# EAGLE design stamp-fixed-mk-4.1 (EAGLE 6.5.0)
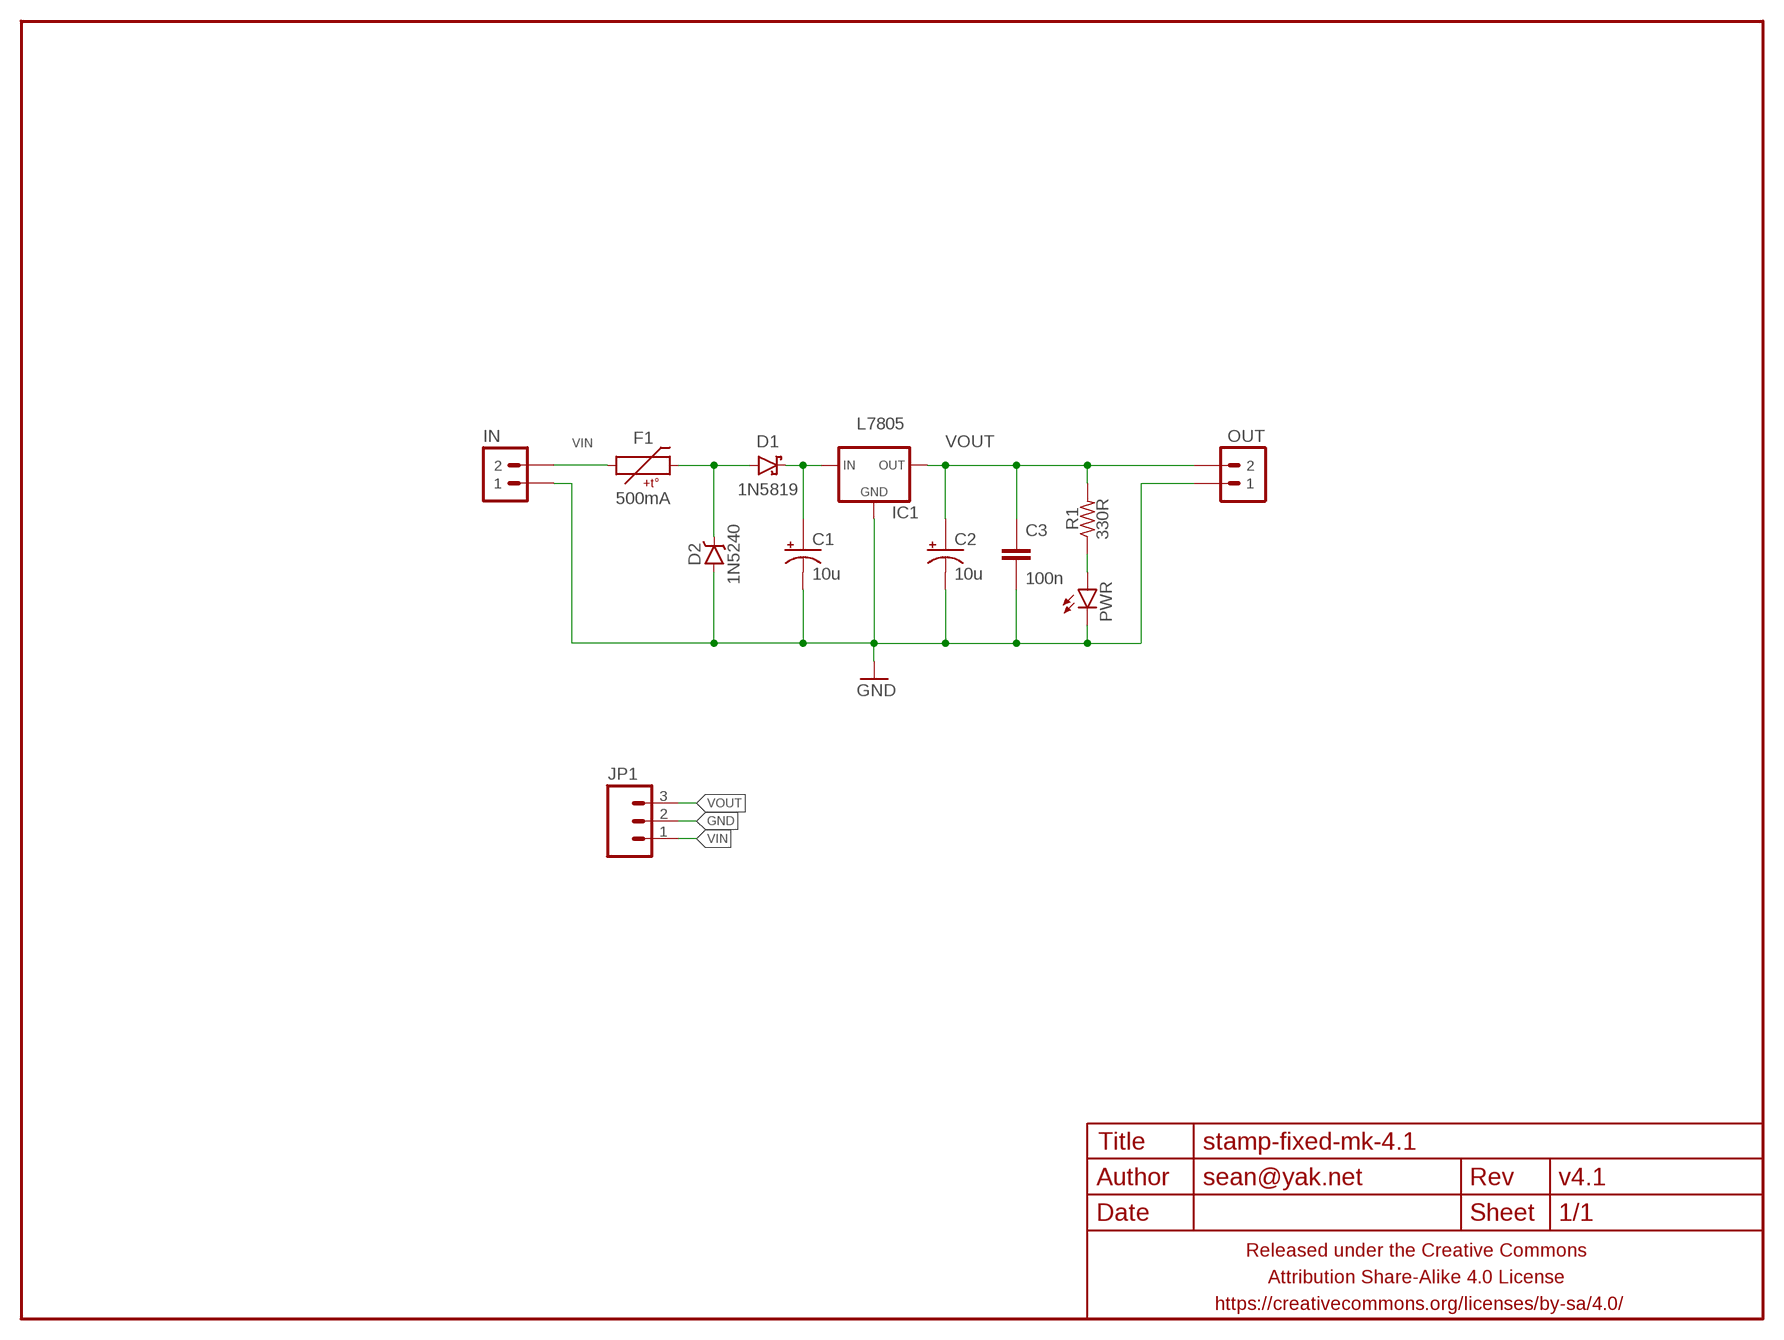
[diagram p0: schematic, sheet 1]

## Parts
C1  10u  CAPACITOR-POLARIZEDE2.5-5  [E2,5-5]
C2  10u  CAPACITOR-POLARIZEDE2.5-5  [E2,5-5]
C3  100n  CAPACITOR-CERAMIC025-024X044  [C025-024X044]
D1  1N5819  DIODE-SCHOTTKYPTH-10.16MM  [DIODE-SCHOTTKY-10.16MM]
D2  1N5240  DIODE-ZENER10.16MM-PTH  [DIODE-ZENNER-10.16MM]
F1  500mA  PTCPTH-5.08MM  [PTC-PTH-5.08MM]
FRAME1  FRAME-LETTERNO_PACKAGE  [DUMMY]
IC1  L7805  V_REG_78XXTO-220-THERMPAD  [TO220-IGO-THERMPAD]
IN  M02PTH-CENTERED-R+  [1X02-CENTER-R+]
JP1  M03PTH-CENTERED  [1X03-CENTERED]
OUT  M02PTH-CENTERED-R+  [1X02-CENTER-R+]
PWR  LED3MM-LESS  [LED3MM-LESSSILK]
R1  330R  RESISTORPTH-AXIAL-5.08MM  [RESISTOR-AXIAL-PTH-5.08MM]

## Nets
GND: C1.- C2.- C3.2 D2.A IC1.4(GND) IC1.GND IN.1 JP1.2 OUT.1 PWR.K(C)
N$1: PWR.A R1.P$1
N$2: C1.+ D1.C IC1.IN
N$3: D1.A D2.K(C) F1.P$2
VIN: F1.P$1 IN.2 JP1.1
VOUT: C2.+ C3.1 IC1.OUT JP1.3 OUT.2 R1.P$2

## Library data of the parts
C1 C2 = A_butts:CAPACITOR-POLARIZED: POLARIZED CAPACITOR, American symbol
C3 = A_butts:CAPACITOR-CERAMIC: CAPACITOR, European symbol
D1 = A_butts:DIODE-SCHOTTKY: Schottky diodes in SFE's production catalog BAT20J 1A 23V 0.62Vf RB751 120mA 40V 0.37Vf PMEG4005EJ 0.5A 40V 0.42Vf MBRA140 1A 40V 0.5Vf B340A 3A 40V SMA
D2 = A_butts:DIODE-ZENER: Zener Diode Production Part - 8199 3.4V Zener Voltage
F1 = A_butts:PTC: Resettable Fuse PTC Resettable Fuse. Spark Fun Electronics SKU : COM-08357
FRAME1 = A_butts:FRAME-LETTER: Schematic Frame Standard 8.5x11 US Letter frame; DESIGNER: sean@yak.net; VERSION: v4.1
IC1 = A_butts:V_REG_78XX: Voltage Regulator Standard 7805 5V regulator. IGO (Input Ground Output). Spark Fun Electronics SKU : COM-00107
IN OUT = A_butts:M02: Standard 2-pin 0.1" header. Use with - straight break away headers ( PRT-00116) - right angle break away headers (PRT-00553) - swiss pins (PRT-00743) - machine pins (PRT-00117) - female headers (PRT-00115) Molex polarized connector foot print use with: PRT-08233 with associated crimp pins and housings. 2.54_SCREWTERM for use with PRT-10571. 3.5mm Screw Terminal footprints for PRT-08084 5mm Screw Terminal footprints for use with PRT-08433
JP1 = A_butts:M03: Header 3 Standard 3-pin 0.1" header. Use with straight break away headers (SKU : PRT-00116), right angle break away headers (PRT-00553), swiss pins (PRT-00743), machine pins (PRT-00117), and female headers (PRT-00115). Molex polarized connector foot print use with SKU : PRT-08232 with associated crimp pins and housings.
PWR = A_butts:LED: LEDs Standard schematic elements and footprints for 5mm, 3mm, 1206, and 0603 sized LEDs. 5mm - Spark Fun Electronics SKU : COM-00529 (and others)
R1 = A_butts:RESISTOR: RESISTOR, American symbol

## Board
Postage Stamp Power Supply Small linear power supply with flexible layout.
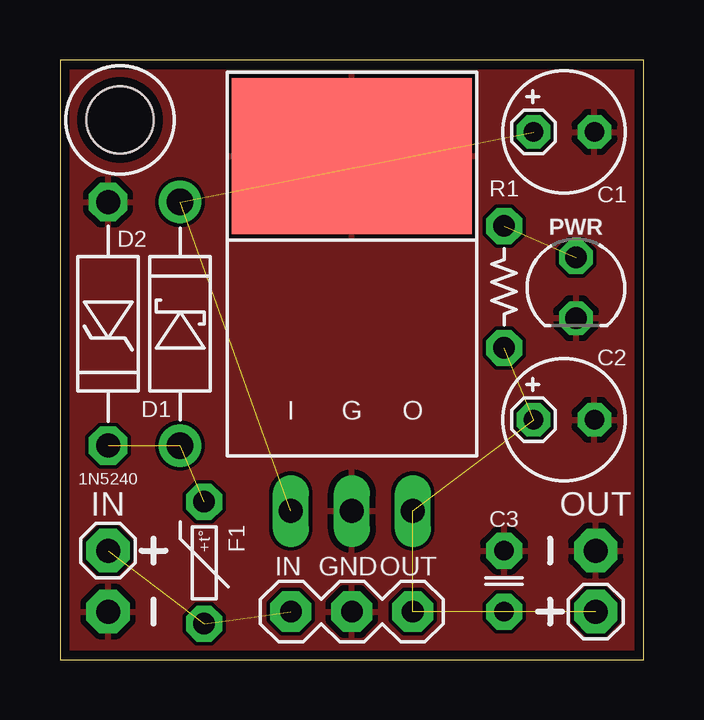
[diagram p1: board, top side]

Size 24.32 x 25 mm. Coordinates in mm from the lower left corner, seen from the top.
Outline: 24.32,0 24.32,25 0,25 0,0 24.32,0
Copper layers (1*16): Top 0.0356mm / dielectric 1.5011mm / Bottom 0.0356mm
Design rules "LaenPCBOrder *": minimum track width 6mil, minimum drill 13mil, track to track 6mil, track to pad 6mil, pad to pad 6mil, via to via 6mil, smd to smd 6mil, copper to edge 15mil, drill to drill 6mil, minimum pad ring 7mil, minimum via ring 7mil, stop-mask expansion 3mil, vias tented up to drill 20mil, thermal gap 10mil
Holes 2.8 mm at 2.5,22.5

### Footprints (pad centres in the part's own frame; a part is rotated, then mirrored left to right if it is on the bottom)
E2,5-5 = drill 0.8 pad 1.4 octagon: + -1.27,0; - 1.27,0
C025-024X044 = drill 0.813 pad 1.5 octagon: 1 -1.27,0; 2 1.27,0
DIODE-SCHOTTKY-10.16MM = drill 1.1 pad 1.778: A -5.08,0; C 5.08,0
DIODE-ZENNER-10.16MM = drill 1 pad 1.6 octagon: A -5.08,0; K 5.08,0
PTC-PTH-5.08MM = drill 0.9 pad 1.5 octagon: P$1 -2.54,0; P$2 2.54,0
TO220-IGO-THERMPAD = smd 10 x 6.5: 4 0,11 | drill 1 long: GND 0,-3.81; IN -2.54,-3.81; OUT 2.54,-3.81
1X02-CENTER-R+ = drill 1 pad 1.8 octagon: 1 -1.27,0; 2 1.27,0
1X03-CENTERED = drill 0.9 pad 1.7 octagon: 1 -2.54,0; 2 0,0; 3 2.54,0
LED3MM-LESSSILK = drill 0.9 pad 1.4 octagon: A -1.27,0; K 1.27,0
RESISTOR-AXIAL-PTH-5.08MM = drill 0.9 pad 1.5 octagon: P$1 -2.54,0; P$2 2.54,0

### Placement (x,y rotation side)
C1  21,22 0 top
C2  21,10 0 top
C3  18.5,3.27 90 top
D1  5,14 90 top
D2  2,14 270 top
F1  6,4.04 90 top
FRAME1  0,-0.5 0 top
IC1  12.16,10 0 top
IN  2,3.27 90 top
JP1  12.16,2 0 top
OUT  22.32,3.27 270 top
PWR  21.5,15.5 270 top
R1  18.5,15.54 270 top

### Tracks (layer width: path | path; a pad name or v marks a point on that pad's centre or on a via)
GND
  pour Top: 0,0 0,25 24.32,25 24.32,0
N$1  (1 unrouted)
N$2  (2 unrouted)
N$3  (2 unrouted)
VIN  (2 unrouted)
VOUT  (5 unrouted)

### Text on the board
tPlace: IN | GND | OUT